# EAGLE design POVWand16 (EAGLE 9.6.0)

## Sheet 1 of 3
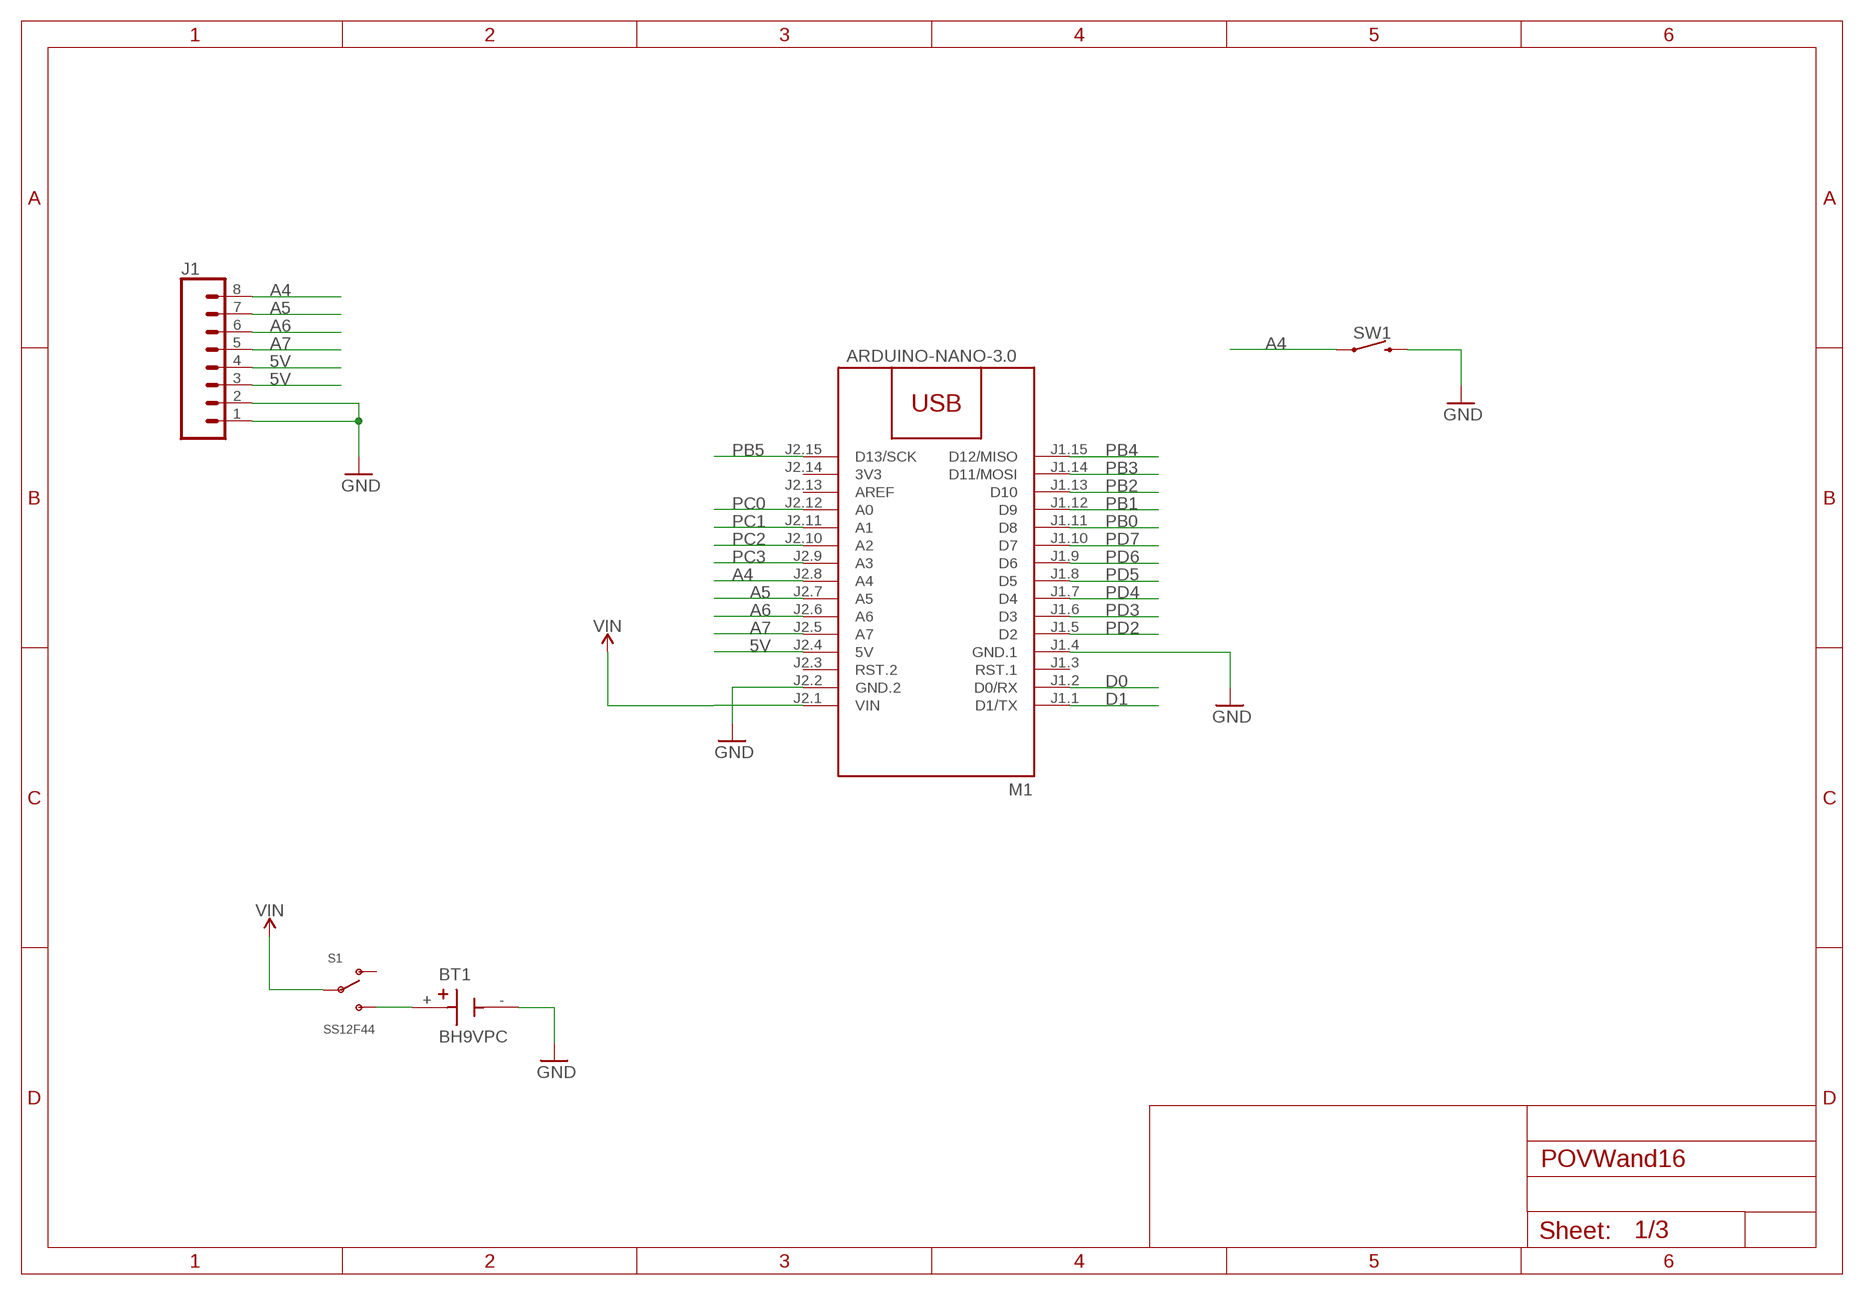
[diagram p0: schematic, sheet 1]

### Parts
BT1  BH9VPC  [BAT_BH9VPC]
J1  CONN_08"  [1X08]
M1  ARDUINO-NANO-3.0  [ARDUINO-NANO-3.0]
S1  SS12F44  [SS12F44G5]
SW1  MOMENTARY-SWITCH-SPST_6X6MM  [TACT_SW_PTH_6.0MM]

### Nets
5V: J1.3 J1.4 M1.J2.4(5V)
A4: J1.8 M1.J2.8(A4) SW1.1 SW1.2
A5: J1.7 M1.J2.7(A5)
A6: J1.6 M1.J2.6(A6)
A7: J1.5 M1.J2.5(A7)
D0: M1.J1.2(D0/RX) ; also sheet 3
D1: M1.J1.1(D1/TX) ; also sheet 3
GND: BT1.- J1.1 J1.2 M1.J1.4(GND.1) M1.J2.2(GND.2) SW1.3 SW1.4 ; also sheet 2
N$17: BT1.+ S1.3(S)
PB0: M1.J1.11(D8) ; also sheet 2
PB1: M1.J1.12(D9) ; also sheet 2
PB2: M1.J1.13(D10) ; also sheet 2
PB3: M1.J1.14(D11/MOSI) ; also sheet 2
PB4: M1.J1.15(D12/MISO) ; also sheet 2
PB5: M1.J2.15(D13/SCK) ; also sheet 2
PC0: M1.J2.12(A0) ; also sheet 2
PC1: M1.J2.11(A1) ; also sheet 2
PC2: M1.J2.10(A2) ; also sheet 2
PC3: M1.J2.9(A3) ; also sheet 2
PD2: M1.J1.5(D2) ; also sheet 2
PD3: M1.J1.6(D3) ; also sheet 2
PD4: M1.J1.7(D4) ; also sheet 2
PD5: M1.J1.8(D5) ; also sheet 2
PD6: M1.J1.9(D6) ; also sheet 2
PD7: M1.J1.10(D7) ; also sheet 2
VIN: M1.J2.1(VIN) S1.2(P)
Unconnected: M1.J1.3(RST.1) M1.J2.3(RST.2) M1.J2.13(AREF) S1.1(O)

## Sheet 2 of 3
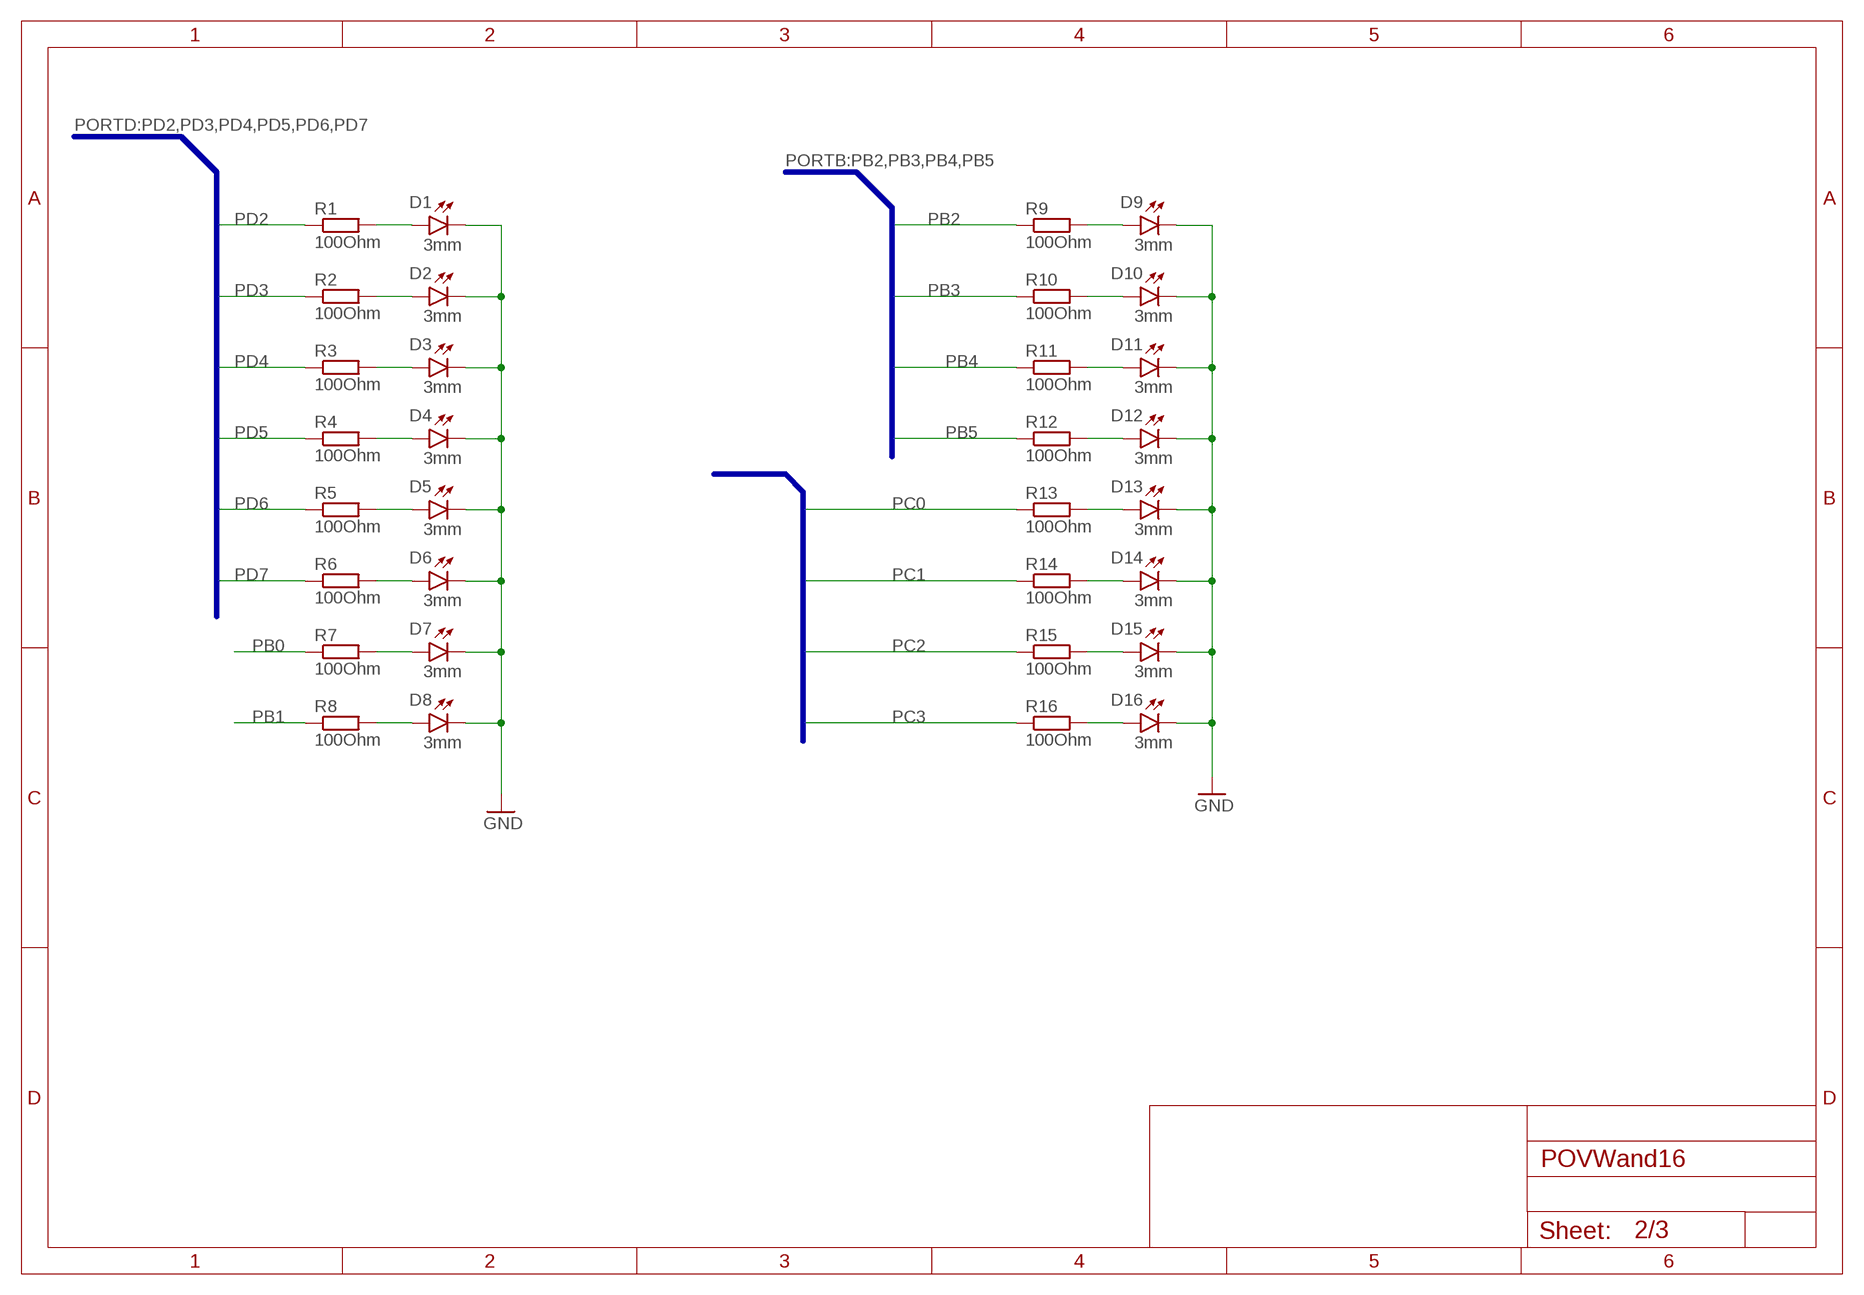
[diagram p1: schematic, sheet 2]

### Parts
D1  3mm  LED_T/H_RADIAL_3MM  [LED3MM]
D2  3mm  LED_T/H_RADIAL_3MM  [LED3MM]
D3  3mm  LED_T/H_RADIAL_3MM  [LED3MM]
D4  3mm  LED_T/H_RADIAL_3MM  [LED3MM]
D5  3mm  LED_T/H_RADIAL_3MM  [LED3MM]
D6  3mm  LED_T/H_RADIAL_3MM  [LED3MM]
D7  3mm  LED_T/H_RADIAL_3MM  [LED3MM]
D8  3mm  LED_T/H_RADIAL_3MM  [LED3MM]
D9  3mm  LED_T/H_RADIAL_3MM  [LED3MM]
D10  3mm  LED_T/H_RADIAL_3MM  [LED3MM]
D11  3mm  LED_T/H_RADIAL_3MM  [LED3MM]
D12  3mm  LED_T/H_RADIAL_3MM  [LED3MM]
D13  3mm  LED_T/H_RADIAL_3MM  [LED3MM]
D14  3mm  LED_T/H_RADIAL_3MM  [LED3MM]
D15  3mm  LED_T/H_RADIAL_3MM  [LED3MM]
D16  3mm  LED_T/H_RADIAL_3MM  [LED3MM]
R1  100Ohm  100R_RESISTOR_T/H_0207/7  [0207/7]
R2  100Ohm  100R_RESISTOR_T/H_0207/7  [0207/7]
R3  100Ohm  100R_RESISTOR_T/H_0207/7  [0207/7]
R4  100Ohm  100R_RESISTOR_T/H_0207/7  [0207/7]
R5  100Ohm  100R_RESISTOR_T/H_0207/7  [0207/7]
R6  100Ohm  100R_RESISTOR_T/H_0207/7  [0207/7]
R7  100Ohm  100R_RESISTOR_T/H_0207/7  [0207/7]
R8  100Ohm  100R_RESISTOR_T/H_0207/7  [0207/7]
R9  100Ohm  100R_RESISTOR_T/H_0207/7  [0207/7]
R10  100Ohm  100R_RESISTOR_T/H_0207/7  [0207/7]
R11  100Ohm  100R_RESISTOR_T/H_0207/7  [0207/7]
R12  100Ohm  100R_RESISTOR_T/H_0207/7  [0207/7]
R13  100Ohm  100R_RESISTOR_T/H_0207/7  [0207/7]
R14  100Ohm  100R_RESISTOR_T/H_0207/7  [0207/7]
R15  100Ohm  100R_RESISTOR_T/H_0207/7  [0207/7]
R16  100Ohm  100R_RESISTOR_T/H_0207/7  [0207/7]

### Nets
GND: D1.K(C) D2.K(C) D3.K(C) D4.K(C) D5.K(C) D6.K(C) D7.K(C) D8.K(C) D9.K(C) D10.K(C) D11.K(C) D12.K(C) D13.K(C) D14.K(C) D15.K(C) D16.K(C) ; also sheet 1
N$1: D1.A R1.2
N$2: D2.A R2.2
N$3: D3.A R3.2
N$4: D4.A R4.2
N$5: D5.A R5.2
N$6: D6.A R6.2
N$7: D7.A R7.2
N$8: D8.A R8.2
N$9: D9.A R9.2
N$10: D10.A R10.2
N$11: D11.A R11.2
N$12: D12.A R12.2
N$13: D13.A R13.2
N$14: D14.A R14.2
N$15: D15.A R15.2
N$16: D16.A R16.2
PB0: R7.1 ; also sheet 1
PB1: R8.1 ; also sheet 1
PB2: R9.1 ; also sheet 1
PB3: R10.1 ; also sheet 1
PB4: R11.1 ; also sheet 1
PB5: R12.1 ; also sheet 1
PC0: R13.1 ; also sheet 1
PC1: R14.1 ; also sheet 1
PC2: R15.1 ; also sheet 1
PC3: R16.1 ; also sheet 1
PD2: R1.1 ; also sheet 1
PD3: R2.1 ; also sheet 1
PD4: R3.1 ; also sheet 1
PD5: R4.1 ; also sheet 1
PD6: R5.1 ; also sheet 1
PD7: R6.1 ; also sheet 1

### Buses
PORTD:PD2,PD3,PD4,PD5,PD6,PD7
PORTB:PB2,PB3,PB4,PB5
PORTC:PC0,PC1,PC2,PC3

## Sheet 3 of 3
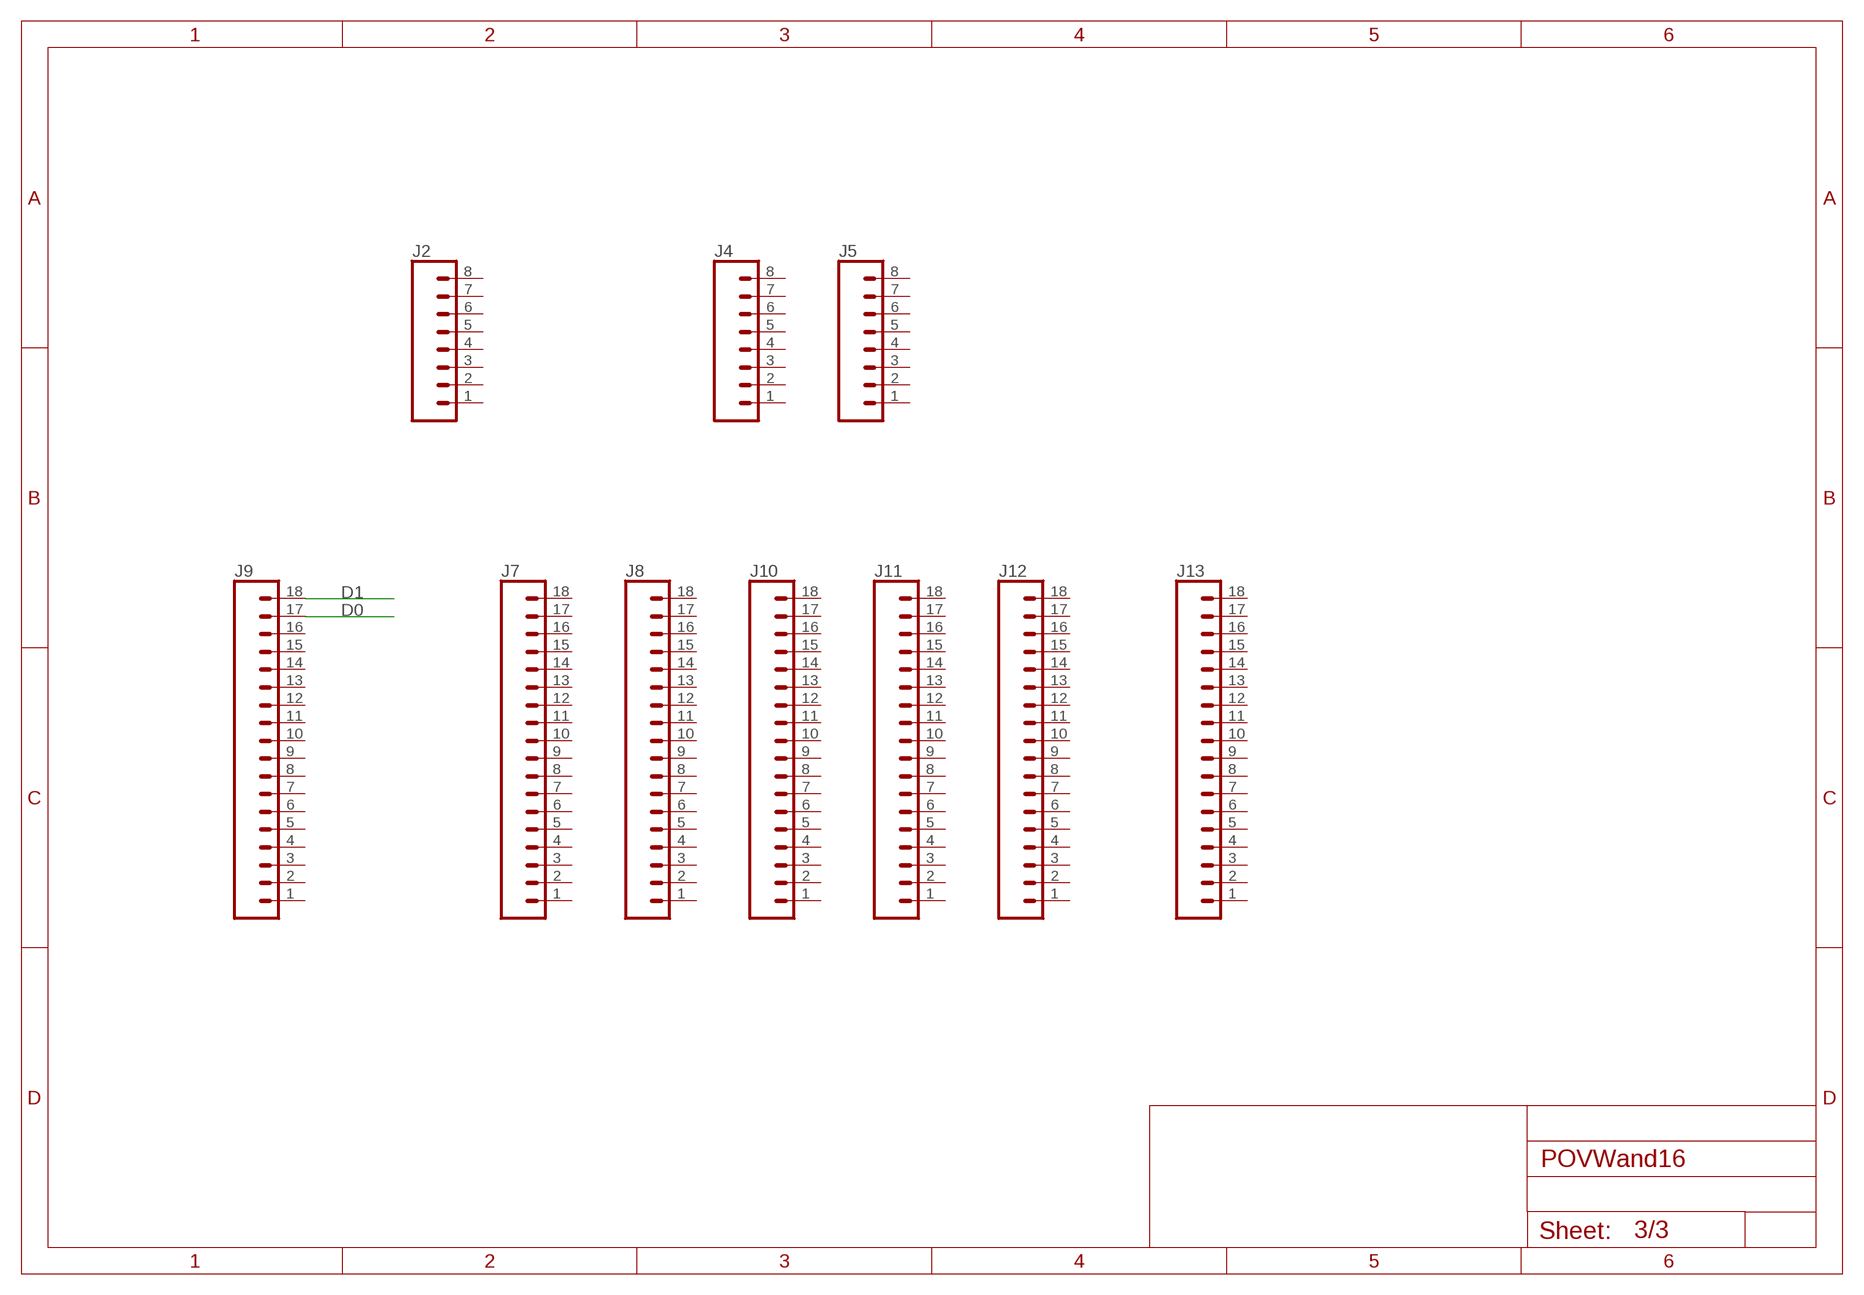
[diagram p2: schematic, sheet 3]

### Parts
J2  CONN_08"  [1X08]
J4  CONN_08"  [1X08]
J5  CONN_08"  [1X08]
J7  CONN_18  [1X18]
J8  CONN_18  [1X18]
J9  CONN_18  [1X18]
J10  CONN_18  [1X18]
J11  CONN_18  [1X18]
J12  CONN_18  [1X18]
J13  CONN_18  [1X18]

### Nets
D0: J9.17 ; also sheet 1
D1: J9.18 ; also sheet 1
Unconnected: J2.1 J2.2 J2.3 J2.4 J2.5 J2.6 J2.7 J2.8 J4.1 J4.2 J4.3 J4.4 J4.5 J4.6 J4.7 J4.8 J5.1 J5.2 J5.3 J5.4 J5.5 J5.6 J5.7 J5.8 J7.1 J7.2 J7.3 J7.4 J7.5 J7.6 J7.7 J7.8 J7.9 J7.10 J7.11 J7.12 J7.13 J7.14 J7.15 J7.16 J7.17 J7.18 J8.1 J8.2 J8.3 J8.4 J8.5 J8.6 J8.7 J8.8 J8.9 J8.10 J8.11 J8.12 J8.13 J8.14 J8.15 J8.16 J8.17 J8.18 J9.1 J9.2 J9.3 J9.4 J9.5 J9.6 J9.7 J9.8 J9.9 J9.10 J9.11 J9.12 J9.13 J9.14 J9.15 J9.16 J10.1 J10.2 J10.3 J10.4 J10.5 J10.6 J10.7 J10.8 J10.9 J10.10 J10.11 J10.12 J10.13 J10.14 J10.15 J10.16 J10.17 J10.18 J11.1 J11.2 J11.3 J11.4 J11.5 J11.6 J11.7 J11.8 J11.9 J11.10 J11.11 J11.12 J11.13 J11.14 J11.15 J11.16 J11.17 J11.18 J12.1 J12.2 J12.3 J12.4 J12.5 J12.6 J12.7 J12.8 J12.9 J12.10 J12.11 J12.12 J12.13 J12.14 J12.15 J12.16 J12.17 J12.18 J13.1 J13.2 J13.3 J13.4 J13.5 J13.6 J13.7 J13.8 J13.9 J13.10 J13.11 J13.12 J13.13 J13.14 J13.15 J13.16 J13.17 J13.18

## Power pins joined to a net without a drawn wire
3V3: M1.J2.14(3V3)

## Library data of the parts
BT1 = OF-Battery:BH9VPC: 9V Battery Holder; DESCRIPTION: Battery Holder _Open_ 9V 1 Cell PC Pin; MF: MPD _Memory; MPN: BH9VPC
D1-D16 = OF-LED:LED_T/H; FOOTPRINT: RADIAL 3MM
J1 J2 J4 J5 = SparkFun-Connectors:CONN_08: Multi connection point. Often used as Generic Header-pin footprint for 0.1 inch spaced/style header connections On any of the 0.1 inch spaced packages, you can populate with these: Break Away Headers - Straight <https://www.sparkfun.com/products/116> (PRT-00116) Break Away Male Headers - Right Angle <https://www.sparkfun.com/products/553> (PRT-00553) Female Headers <https://www.sparkfun.com/products/115> (PRT-00115) Break Away Headers - Machine Pin <https://www.sparkfun.com/products/117> (PRT-00117) Break Away Female Headers - Swiss Machine Pin <https://www.sparkfun.com/products/743> (PRT-00743) Arduino Stackable Header - 8 Pin <https://www.sparkfun.com/products/9279> (PRT-09279) For SCREWTERMINALS and SPRING TERMINALS visit here: Screw Terimnals on SparkFun.com <https://www.sparkfun.com/search/results?term=Screw+Terminals> (5mm/3.5mm/2.54mm spacing) This device is also useful as a general connection point to wire up your design to another part of your project. Our various solder wires solder well into these plated through hole pads. Hook-Up Wire - Assortment (Stranded, 22 AWG) <https://www.sparkfun.com/products/11375> (PRT-11375) Hook-Up Wire - Assortment (Solid Core, 22 AWG) <https://www.sparkfun.com/products/11367> (PRT-11367) View the entire wire category on our website here <https://www.sparkfun.com/categories/141> Special notes: Molex polarized connector foot print use with SKU : PRT-08231 with associated crimp pins and housings. 1MM SMD Version SKU: PRT-10208 NOTES ON THE VARIANTS LOCK and LOCK_LONGPADS... This footprint was designed to help hold the alignment of a through-hole component (i.e. 6-pin header) while soldering it into place. You may notice that each hole has been shifted either up or down by 0.005 of an inch from it's more standard position (which is a perfectly straight line). This slight alteration caused the pins (the squares in the middle) to touch the edges of the holes. Because they are alternating, it causes a "brace" to hold the component in place. 0.005 has proven to be the perfect amount of "off-center" position when using our standard breakaway headers. Although looks a little odd when you look at the bare footprint, once you have a header in there, the alteration is very hard to notice. Also,if you push a header all the way into place, it is covered up entirely on the bottom side.; PROD_ID: CONN-08438
J7-J13 = SparkFun-Connectors:CONN_18: Multi connection point. Often used as Generic Header-pin footprint for 0.1 inch spaced/style header connections On any of the 0.1 inch spaced packages, you can populate with these: Break Away Headers - Straight <https://www.sparkfun.com/products/116> (PRT-00116) Break Away Male Headers - Right Angle <https://www.sparkfun.com/products/553> (PRT-00553) Female Headers <https://www.sparkfun.com/products/115> (PRT-00115) Break Away Headers - Machine Pin <https://www.sparkfun.com/products/117> (PRT-00117) Break Away Female Headers - Swiss Machine Pin <https://www.sparkfun.com/products/743> (PRT-00743) For SCREWTERMINALS and SPRING TERMINALS visit here: Screw Terimnals on SparkFun.com <https://www.sparkfun.com/search/results?term=Screw+Terminals> (5mm/3.5mm/2.54mm spacing) This device is also useful as a general connection point to wire up your design to another part of your project. Our various solder wires solder well into these plated through hole pads. Hook-Up Wire - Assortment (Stranded, 22 AWG) <https://www.sparkfun.com/products/11375> (PRT-11375) Hook-Up Wire - Assortment (Solid Core, 22 AWG) <https://www.sparkfun.com/products/11367> (PRT-11367) View the entire wire category on our website here <https://www.sparkfun.com/categories/141> Special notes: Molex polarized connector foot print use with SKU : PRT-08231 with associated crimp pins and housings. 1MM SMD Version SKU: PRT-10208 NOTES ON THE VARIANTS LOCK and LOCK_LONGPADS... This footprint was designed to help hold the alignment of a through-hole component (i.e. 6-pin header) while soldering it into place. You may notice that each hole has been shifted either up or down by 0.005 of an inch from it's more standard position (which is a perfectly straight line). This slight alteration caused the pins (the squares in the middle) to touch the edges of the holes. Because they are alternating, it causes a "brace" to hold the component in place. 0.005 has proven to be the perfect amount of "off-center" position when using our standard breakaway headers. Although looks a little odd when you look at the bare footprint, once you have a header in there, the alteration is very hard to notice. Also,if you push a header all the way into place, it is covered up entirely on the bottom side.
M1 = OF-Misc:ARDUINO-NANO-3.0: Arduino Nano 3.0 and compatible devices
R1-R16 = OF-Resistors:100R_RESISTOR; FOOTPRINT: T/H
S1 = OF-Switches:SS12F44: based on: SLIDE SWITCH 1P2T THROUGH HOLE 0.5A 50VDC <https://www.taydaelectronics.com/electromechanical/switches-key-pad/slide-switch/slide-switch-1p2t-through-hole-0-5a-50vdc.html>; MPN: SS12F44G5
SW1 = OF-Switches:MOMENTARY-SWITCH-SPST: Momentary Switch (Pushbutton) - SPST Normally-open (NO) SPST momentary switches (buttons, pushbuttons).; DESCRIPTION: SWITCH TACTILE SPST-NO 0.05A 12V; FOOTPRINT: 6.00mm x 6.00mm; MF: C&K; MPN: PTS645SM43-2 LFS

## Board
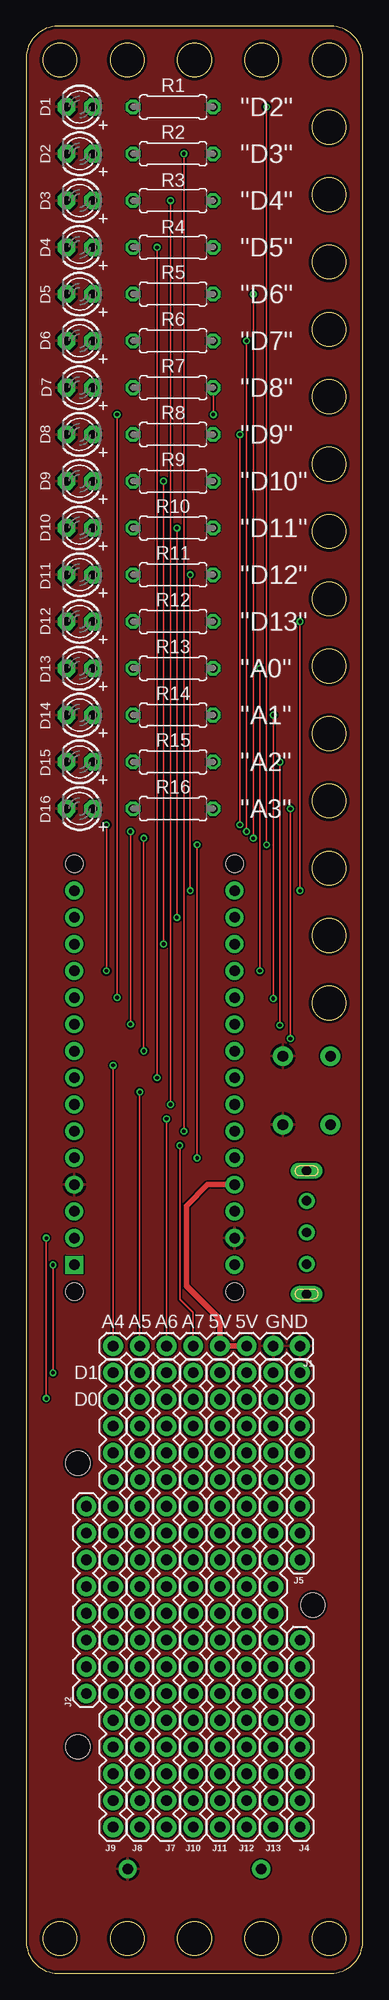
[diagram p3: board, top side]
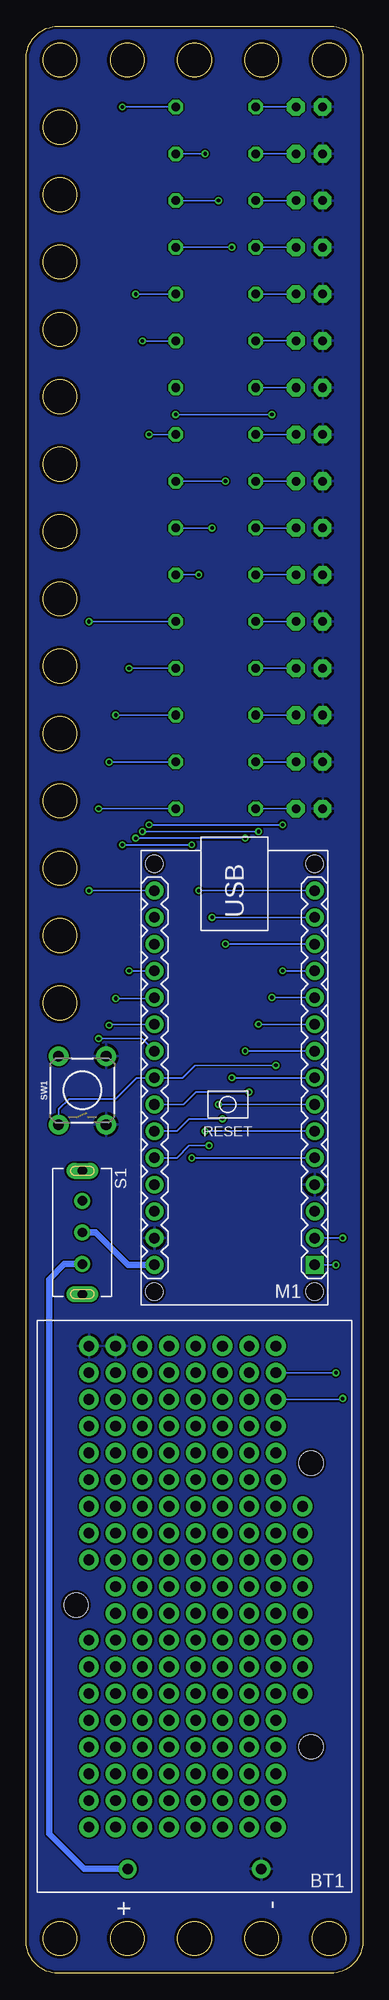
[diagram p4: board, bottom side, seen from below]

Size 32 x 185 mm. Coordinates in mm from the lower left corner, seen from the top.
Outline: 3,0 29,0 arc90 32,3 32,182 arc90 29,185 3,185 arc90 0,182 0,3 arc90 3,0
Outline: circle at 9.6,3.3 radius 1.6
Outline: circle at 3.2,3.3 radius 1.6
Outline: circle at 28.8,3.3 radius 1.6
Outline: circle at 22.4,3.3 radius 1.6
Outline: circle at 16,3.3 radius 1.6
Outline: circle at 9.6,181.8 radius 1.6
Outline: circle at 3.2,181.8 radius 1.6
Outline: circle at 28.8,181.8 radius 1.6
Outline: circle at 22.4,181.8 radius 1.6
Outline: circle at 16,181.8 radius 1.6
Outline: circle at 28.8,175.4 radius 1.6
Outline: circle at 28.8,169 radius 1.6
Outline: circle at 28.8,162.6 radius 1.6
Outline: circle at 28.8,156.2 radius 1.6
Outline: circle at 28.8,149.8 radius 1.6
Outline: circle at 28.8,143.4 radius 1.6
Outline: circle at 28.8,137 radius 1.6
Outline: circle at 28.8,130.6 radius 1.6
Outline: circle at 28.8,124.2 radius 1.6
Outline: circle at 28.8,117.8 radius 1.6
Copper layers (1*16): Top 0.035mm / dielectric 1.5mm / Bottom 0.035mm
Design rules "SeeedStudio_2layer_DRU_no_angle_20140221 *": minimum track width 6mil, minimum drill 12mil, track to track 6mil, track to pad 6mil, pad to pad 6mil, via to via 6mil, smd to smd 0mil, copper to edge 10mil, drill to drill 10mil, minimum pad ring 10mil, minimum via ring 6mil, stop-mask expansion 2mil, vias tented up to drill 100mil, thermal gap 10mil

### Footprints (pad centres in the part's own frame; a part is rotated, then mirrored left to right if it is on the bottom)
BAT_BH9VPC = drill 1.016: + 24.945,-6.35; - 24.945,6.35 | hole 2.29: -0.135,-11.26; -13.625,11.09; 13.345,11.09
LED3MM = drill 0.813 pad 1.676 octagon: A -1.27,0; K 1.27,0
1X08 = drill 1.016 pad 1.88: 1 0,0; 2 2.54,0; 3 5.08,0; 4 7.62,0; 5 10.16,0; 6 12.7,0; 7 15.24,0; 8 17.78,0
1X18 = drill 1.016 pad 1.88: 1 0,0; 2 2.54,0; 3 5.08,0; 4 7.62,0; 5 10.16,0; 6 12.7,0; 7 15.24,0; 8 17.78,0; 9 20.32,0; 10 22.86,0; 11 25.4,0; 12 27.94,0; 13 30.48,0; 14 33.02,0; 15 35.56,0; 16 38.1,0; 17 40.64,0; 18 43.18,0
ARDUINO-NANO-3.0 = drill 1 square: J1.1 17.78,7.62 | drill 1: J1.2 15.24,7.62; J1.3 12.7,7.62; J1.4 10.16,7.62; J1.5 7.62,7.62; J1.6 5.08,7.62; J1.7 2.54,7.62; J1.8 0,7.62; J1.9 -2.54,7.62; J1.10 -5.08,7.62; J1.11 -7.62,7.62; J1.12 -10.16,7.62; J1.13 -12.7,7.62; J1.14 -15.24,7.62; J1.15 -17.78,7.62; J2.1 17.78,-7.62; J2.2 15.24,-7.62; J2.3 12.7,-7.62; J2.4 10.16,-7.62; J2.5 7.62,-7.62; J2.6 5.08,-7.62; J2.7 2.54,-7.62; J2.8 0,-7.62; J2.9 -2.54,-7.62; J2.10 -5.08,-7.62; J2.11 -7.62,-7.62; J2.12 -10.16,-7.62; J2.13 -12.7,-7.62; J2.14 -15.24,-7.62; J2.15 -17.78,-7.62 | hole 1.651: -20.32,7.62; -20.32,-7.62; 20.32,-7.62; 20.32,7.62
0207/7 = drill 0.813 octagon: 1 -3.81,0; 2 3.81,0
SS12F44G5 = drill 0.9: 1 -3,0; 2 0,0; 3 3,0 | drill 0.9 long: H1 -5.85,0; H2 5.85,0
TACT_SW_PTH_6.0MM = drill 1.016 pad 1.88: 1 -3.251,2.261; 2 3.251,2.261; 3 -3.251,-2.261; 4 3.251,-2.261

### Placement (x,y rotation side)
BT1  16,34.85 270 bottom
D1  5.08,177.34 180 top
D2  5.08,172.89 180 top
D3  5.08,168.44 180 top
D4  5.08,164 180 top
D5  5.08,159.56 180 top
D6  5.08,155.11 180 top
D7  5.08,150.66 180 top
D8  5.08,146.22 180 top
D9  5.08,141.78 180 top
D10  5.08,137.33 180 top
D11  5.08,132.88 180 top
D12  5.08,128.44 180 top
D13  5.08,124 180 top
D14  5.08,119.55 180 top
D15  5.08,115.11 180 top
D16  5.08,110.66 180 top
J1  26.04,59.59 180 top
J2  5.71,26.57 90 top
J4  26.04,13.88 90 top
J5  26.04,39.27 90 top
J7  13.34,13.88 90 top
J8  10.79,13.88 90 top
J9  8.26,13.88 90 top
J10  15.88,13.88 90 top
J11  18.41,13.88 90 top
J12  20.95,13.88 90 top
J13  23.5,13.88 90 top
M1  12.19,85.09 270 bottom
R1  13.97,177.34 180 top
R2  13.97,172.89 180 top
R3  13.97,168.44 180 top
R4  13.97,164 180 top
R5  13.97,159.56 180 top
R6  13.97,155.11 180 top
R7  13.97,150.66 180 top
R8  13.97,146.22 180 top
R9  13.97,141.78 180 top
R10  13.97,137.33 180 top
R11  13.97,132.88 180 top
R12  13.97,128.44 180 top
R13  13.97,124 180 top
R14  13.97,119.55 180 top
R15  13.97,115.11 180 top
R16  13.97,110.66 180 top
S1  26.67,70.39 270 bottom
SW1  26.67,83.89 90 bottom

### Tracks (layer width: path | path; a pad name or v marks a point on that pad's centre or on a via)
5V
  Top 0.508: M1.J2.4 17.24,74.93 15.24,72.93 15.24,65.31 18.41,62.13 J1.4 J1.3
A4  (via drill 0.35)
  Top 0.152: J1.8 v8.26,86.27
  Bottom 0.152: v8.26,86.27 15.97,86.27 17.14,85.09 M1.J2.8 21.5,85.09 23.5,83.09 27.94,83.09 28.93,82.1 SW1.1
A5  (via drill 0.35)
  Top 0.152: J1.7 v10.79,83.72
  Bottom 0.152: v10.79,83.72 15.88,83.72 17.05,82.55 M1.J2.7
A6  (via drill 0.35)
  Top 0.152: J1.6 v13.34,81.19
  Bottom 0.152: v13.34,81.19 16.51,81.19 17.68,80.01 M1.J2.6
A7  (via drill 0.35)
  Top 0.152: J1.5 15.88,62.77 14.61,64.04 v14.61,78.64
  Bottom 0.152: v14.61,78.64 16.51,78.64 17.68,77.47 M1.J2.5
D0  (via drill 0.35)
  Top 0.152: v1.91,54.61 v1.91,69.85
  Bottom 0.152: J9.17 2,54.52 v1.91,54.61 | v1.91,69.85 M1.J1.2
D1  (via drill 0.35)
  Top 0.152: v2.54,67.31 v2.54,57.05
  Bottom 0.152: M1.J1.1 v2.54,67.31 | v2.54,57.05 | J9.18 v2.54,57.05 | v2.54,57.05
GND
  pour Top: 3,0 arc-90 0,3 0,182 arc-90 3,185 29,185 arc-90 32,182 32,3 arc-90 29,0
  pour Bottom: 3,0 arc-90 0,3 0,182 arc-90 3,185 29,185 arc-90 32,182 32,3 arc-90 29,0
N$1
  Bottom 0.152: D1.A R1.2
N$2
  Bottom 0.152: D2.A R2.2
N$3
  Bottom 0.152: D3.A R3.2
N$4
  Bottom 0.152: D4.A R4.2
N$5
  Bottom 0.152: D5.A R5.2
N$6
  Bottom 0.152: D6.A R6.2
N$7
  Bottom 0.152: D7.A R7.2
N$8
  Bottom 0.152: D8.A R8.2
N$9
  Bottom 0.152: D9.A R9.2
N$10
  Bottom 0.152: D10.A R10.2
N$11
  Bottom 0.152: D11.A R11.2
N$12
  Bottom 0.152: D12.A R12.2
N$13
  Bottom 0.152: R13.2 D13.A
N$14
  Bottom 0.152: R14.2 D14.A
N$15
  Bottom 0.152: R15.2 D15.A
N$16
  Bottom 0.152: D16.A R16.2
N$17
  Bottom 0.61: BT1.+ 26.51,9.9 29.84,13.24 29.84,65.94 28.4,67.39 S1.3
PB0  (via drill 0.35)
  Top 0.152: v8.64,92.71 v8.64,148.12 | R7.1 17.79,150.65 R7.1 v17.79,148.12
  Bottom 0.152: v17.79,148.12 v8.64,148.12 | M1.J1.11 v8.64,92.71
PB1  (via drill 0.35)
  Top 0.152: v20.32,146.21 v20.32,109.12 | v7.62,109.12 v7.62,95.25
  Bottom 0.152: v20.32,146.21 R8.1 | v20.32,109.12 v7.62,109.12 | v7.62,95.25 M1.J1.12
PB2  (via drill 0.35)
  Top 0.152: v13.05,97.79 v13.05,141.78
  Bottom 0.152: M1.J1.13 v13.05,97.79 | v13.05,141.78 R9.1
PB3  (via drill 0.35)
  Top 0.152: v14.32,100.33 v14.32,137.33
  Bottom 0.152: M1.J1.14 v14.32,100.33 | v14.32,137.33 R10.1
PB4  (via drill 0.35)
  Top 0.152: v15.59,102.87 v15.59,132.88
  Bottom 0.152: M1.J1.15 v15.59,102.87 | v15.59,132.88 R11.1
PB5  (via drill 0.35)
  Top 0.152: v26.04,128.44 v26.04,102.87
  Bottom 0.152: M1.J2.15 v26.04,102.87 | R12.1 v26.04,128.44
PC0  (via drill 0.35)
  Top 0.152: v22.23,124 v22.23,95.25
  Bottom 0.152: M1.J2.12 v22.23,95.25 | R13.1 v22.23,124
PC1  (via drill 0.35)
  Top 0.152: v23.5,119.55 v23.5,92.61
  Bottom 0.152: M1.J2.11 19.91,92.61 v23.5,92.61 | R14.1 v23.5,119.55
PC2  (via drill 0.35)
  Top 0.152: v24.13,115.09 v24.13,90.08
  Bottom 0.152: M1.J2.10 24.13,90.17 v24.13,90.08 | v24.13,115.09 17.79,115.09 R15.1
PC3  (via drill 0.35)
  Top 0.152: v25.12,110.65 v25.12,88.81
  Bottom 0.152: M1.J2.9 20.98,88.81 v25.12,88.81 | v25.12,110.65 R16.1
PD2  (via drill 0.35)
  Top 0.152: v22.86,177.34 v22.86,107.22 | v16.26,107.22 v16.26,77.47
  Bottom 0.152: v22.86,177.34 22.85,177.34 R1.1 | v22.86,107.22 v16.26,107.22 | v16.26,77.47 M1.J1.5
PD3  (via drill 0.35)
  Top 0.152: v14.99,80.01 14.99,170.81 14.99,170.97 v14.99,172.89
  Bottom 0.152: M1.J1.6 v14.99,80.01 | R2.1 15.03,172.89 v14.99,172.89
PD4  (via drill 0.35)
  Top 0.152: v13.72,168.44 v13.72,82.55
  Bottom 0.152: M1.J1.7 v13.72,82.55 | R3.1 13.76,168.44 v13.72,168.44
PD5  (via drill 0.35)
  Top 0.152: v12.45,164 v12.45,85.09
  Bottom 0.152: M1.J1.8 v12.45,85.09 | R4.1 12.49,164 v12.45,164
PD6  (via drill 0.35)
  Top 0.152: v21.59,159.54 v21.59,107.86 | v11.18,87.63 v11.18,107.86
  Bottom 0.152: v21.59,159.54 21.58,159.56 R5.1 | v21.59,107.86 v11.18,107.86 | M1.J1.9 v11.18,87.63
PD7  (via drill 0.35)
  Top 0.152: v9.91,108.49 v9.91,90.17 | v20.95,155.1 v20.95,108.49
  Bottom 0.152: R6.1 v20.95,155.1 | v20.95,108.49 v9.91,108.49 | M1.J1.10 v9.91,90.17
VIN
  Bottom 0.61: M1.J2.1 22.32,67.31 25.4,70.39 S1.2

### Text on the board
tNames: "D2" | "D3" | "D4" | "D5" | "D6" | "D7" | "D8" | "D9" | "D10" | "D11" | "D12" | "D13" | "A0" | "A1" | "A2" | "A3" | A4 | A5 | A6 | A7 | 5V | 5V | GND | D1 | D0